# Altium schematic sheet ZYNQ_DDR3_Bank.SchDoc
size A4
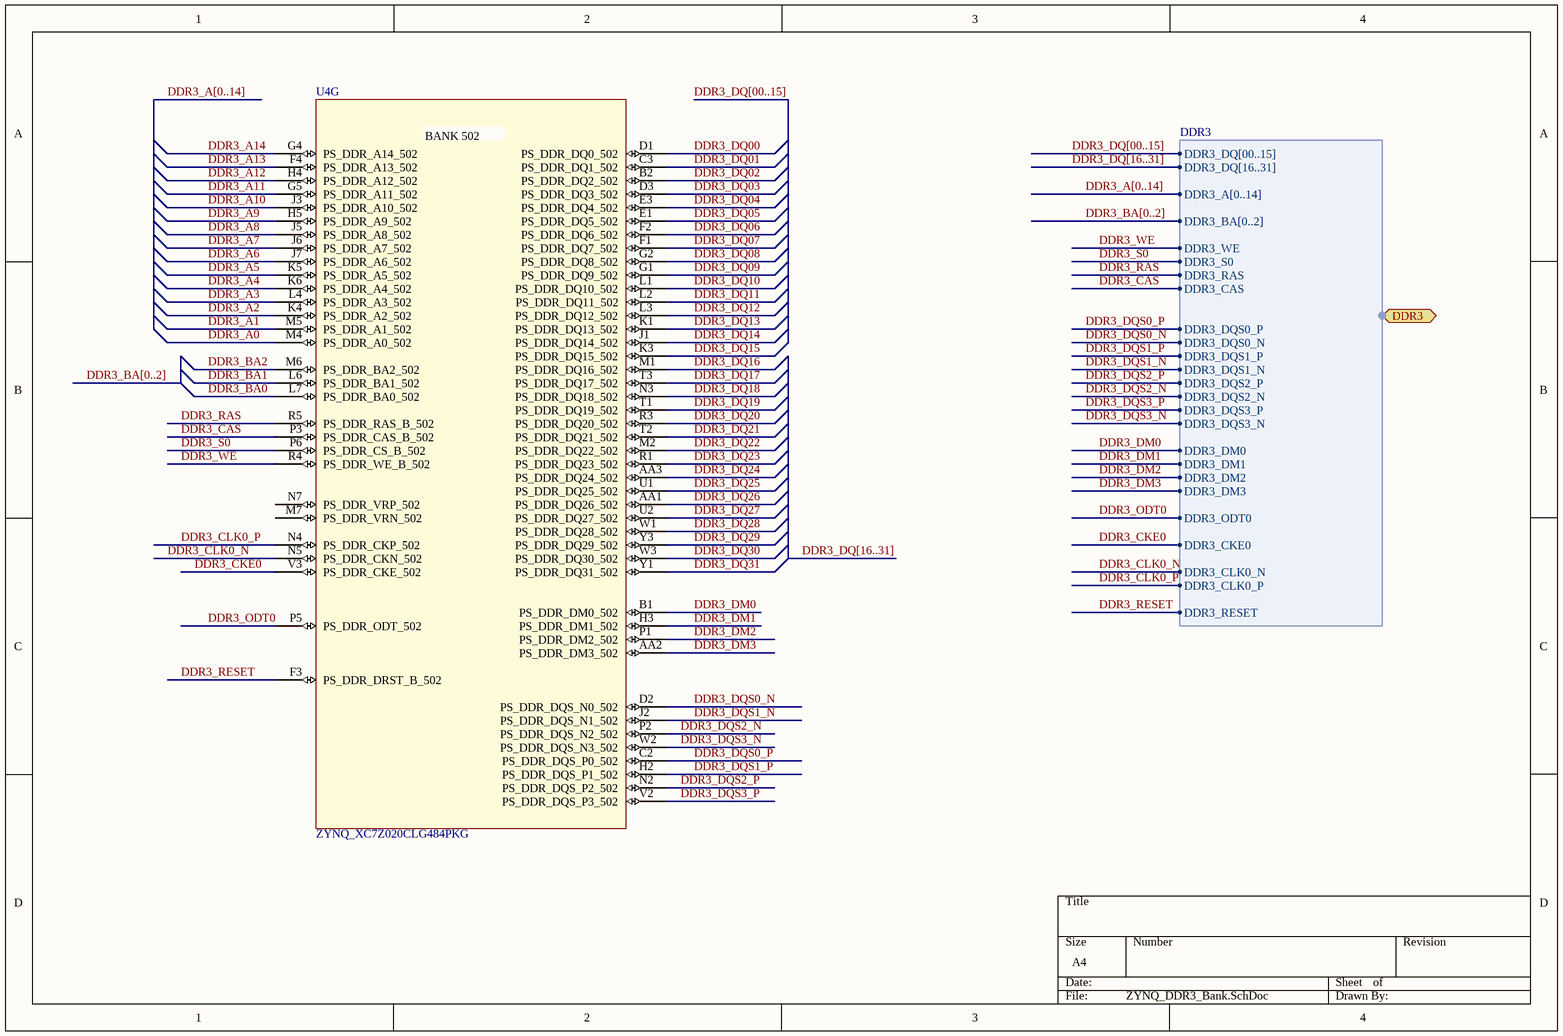
[diagram p0: ZYNQ_DDR3_Bank.SchDoc]

## Parts
U4  ZYNQ_XC7Z020CLG484PKG  (part G of 10)

## Ports
DDR3 (harness DDR3)

## Harnesses
DDR3: DDR3_DQ[00..15], DDR3_DQ[16..31], DDR3_A[0..14], DDR3_BA[0..2], DDR3_WE, DDR3_S0, DDR3_RAS, DDR3_CAS, DDR3_DQS0_P, DDR3_DQS0_N, DDR3_DQS1_P, DDR3_DQS1_N, DDR3_DQS2_P, DDR3_DQS2_N, DDR3_DQS3_P, DDR3_DQS3_N, DDR3_DM0, DDR3_DM1, DDR3_DM2, DDR3_DM3, DDR3_ODT0, DDR3_CKE0, DDR3_CLK0_N, DDR3_CLK0_P, DDR3_RESET

## Nets
DDR3_A0: U4.M4(PS_DDR_A0_502)
DDR3_A1: U4.M5(PS_DDR_A1_502)
DDR3_A2: U4.K4(PS_DDR_A2_502)
DDR3_A3: U4.L4(PS_DDR_A3_502)
DDR3_A4: U4.K6(PS_DDR_A4_502)
DDR3_A5: U4.K5(PS_DDR_A5_502)
DDR3_A6: U4.J7(PS_DDR_A6_502)
DDR3_A7: U4.J6(PS_DDR_A7_502)
DDR3_A8: U4.J5(PS_DDR_A8_502)
DDR3_A9: U4.H5(PS_DDR_A9_502)
DDR3_A10: U4.J3(PS_DDR_A10_502)
DDR3_A11: U4.G5(PS_DDR_A11_502)
DDR3_A12: U4.H4(PS_DDR_A12_502)
DDR3_A13: U4.F4(PS_DDR_A13_502)
DDR3_A14: U4.G4(PS_DDR_A14_502)
DDR3_BA0: U4.L7(PS_DDR_BA0_502)
DDR3_BA1: U4.L6(PS_DDR_BA1_502)
DDR3_BA2: U4.M6(PS_DDR_BA2_502)
DDR3_CAS: U4.P3(PS_DDR_CAS_B_502) ; port DDR3.DDR3_CAS
DDR3_CKE0: U4.V3(PS_DDR_CKE_502) ; port DDR3.DDR3_CKE0
DDR3_CLK0_N: U4.N5(PS_DDR_CKN_502) ; port DDR3.DDR3_CLK0_N
DDR3_CLK0_P: U4.N4(PS_DDR_CKP_502) ; port DDR3.DDR3_CLK0_P
DDR3_DM0: U4.B1(PS_DDR_DM0_502) ; port DDR3.DDR3_DM0
DDR3_DM1: U4.H3(PS_DDR_DM1_502) ; port DDR3.DDR3_DM1
DDR3_DM2: U4.P1(PS_DDR_DM2_502) ; port DDR3.DDR3_DM2
DDR3_DM3: U4.AA2(PS_DDR_DM3_502) ; port DDR3.DDR3_DM3
DDR3_DQ00: U4.D1(PS_DDR_DQ0_502)
DDR3_DQ01: U4.C3(PS_DDR_DQ1_502)
DDR3_DQ02: U4.B2(PS_DDR_DQ2_502)
DDR3_DQ03: U4.D3(PS_DDR_DQ3_502)
DDR3_DQ04: U4.E3(PS_DDR_DQ4_502)
DDR3_DQ05: U4.E1(PS_DDR_DQ5_502)
DDR3_DQ06: U4.F2(PS_DDR_DQ6_502)
DDR3_DQ07: U4.F1(PS_DDR_DQ7_502)
DDR3_DQ08: U4.G2(PS_DDR_DQ8_502)
DDR3_DQ09: U4.G1(PS_DDR_DQ9_502)
DDR3_DQ10: U4.L1(PS_DDR_DQ10_502)
DDR3_DQ11: U4.L2(PS_DDR_DQ11_502)
DDR3_DQ12: U4.L3(PS_DDR_DQ12_502)
DDR3_DQ13: U4.K1(PS_DDR_DQ13_502)
DDR3_DQ14: U4.J1(PS_DDR_DQ14_502)
DDR3_DQ15: U4.K3(PS_DDR_DQ15_502)
DDR3_DQ16: U4.M1(PS_DDR_DQ16_502)
DDR3_DQ17: U4.T3(PS_DDR_DQ17_502)
DDR3_DQ18: U4.N3(PS_DDR_DQ18_502)
DDR3_DQ19: U4.T1(PS_DDR_DQ19_502)
DDR3_DQ20: U4.R3(PS_DDR_DQ20_502)
DDR3_DQ21: U4.T2(PS_DDR_DQ21_502)
DDR3_DQ22: U4.M2(PS_DDR_DQ22_502)
DDR3_DQ23: U4.R1(PS_DDR_DQ23_502)
DDR3_DQ24: U4.AA3(PS_DDR_DQ24_502)
DDR3_DQ25: U4.U1(PS_DDR_DQ25_502)
DDR3_DQ26: U4.AA1(PS_DDR_DQ26_502)
DDR3_DQ27: U4.U2(PS_DDR_DQ27_502)
DDR3_DQ28: U4.W1(PS_DDR_DQ28_502)
DDR3_DQ29: U4.Y3(PS_DDR_DQ29_502)
DDR3_DQ30: U4.W3(PS_DDR_DQ30_502)
DDR3_DQ31: U4.Y1(PS_DDR_DQ31_502)
DDR3_DQS0_N: U4.D2(PS_DDR_DQS_N0_502) ; port DDR3.DDR3_DQS0_N
DDR3_DQS0_P: U4.C2(PS_DDR_DQS_P0_502) ; port DDR3.DDR3_DQS0_P
DDR3_DQS1_N: U4.J2(PS_DDR_DQS_N1_502) ; port DDR3.DDR3_DQS1_N
DDR3_DQS1_P: U4.H2(PS_DDR_DQS_P1_502) ; port DDR3.DDR3_DQS1_P
DDR3_DQS2_N: U4.P2(PS_DDR_DQS_N2_502) ; port DDR3.DDR3_DQS2_N
DDR3_DQS2_P: U4.N2(PS_DDR_DQS_P2_502) ; port DDR3.DDR3_DQS2_P
DDR3_DQS3_N: U4.W2(PS_DDR_DQS_N3_502) ; port DDR3.DDR3_DQS3_N
DDR3_DQS3_P: U4.V2(PS_DDR_DQS_P3_502) ; port DDR3.DDR3_DQS3_P
DDR3_ODT0: U4.P5(PS_DDR_ODT_502) ; port DDR3.DDR3_ODT0
DDR3_RAS: U4.R5(PS_DDR_RAS_B_502) ; port DDR3.DDR3_RAS
DDR3_RESET: U4.F3(PS_DDR_DRST_B_502) ; port DDR3.DDR3_RESET
DDR3_S0: U4.P6(PS_DDR_CS_B_502) ; port DDR3.DDR3_S0
DDR3_WE: U4.R4(PS_DDR_WE_B_502) ; port DDR3.DDR3_WE

Not connected (* = marked no-connect by the designer): U4 M7(PS_DDR_VRN_502) N7(PS_DDR_VRP_502)

## Buses and harness runs
bus DDR3_A[0..14]
bus DDR3_BA[0..2]
bus DDR3_DQ[00..15]
bus DDR3_DQ[16..31]

## Notes on the sheet
- (in symbol ZYNQ_XC7Z020CLG484PKG, part G) BANK 502